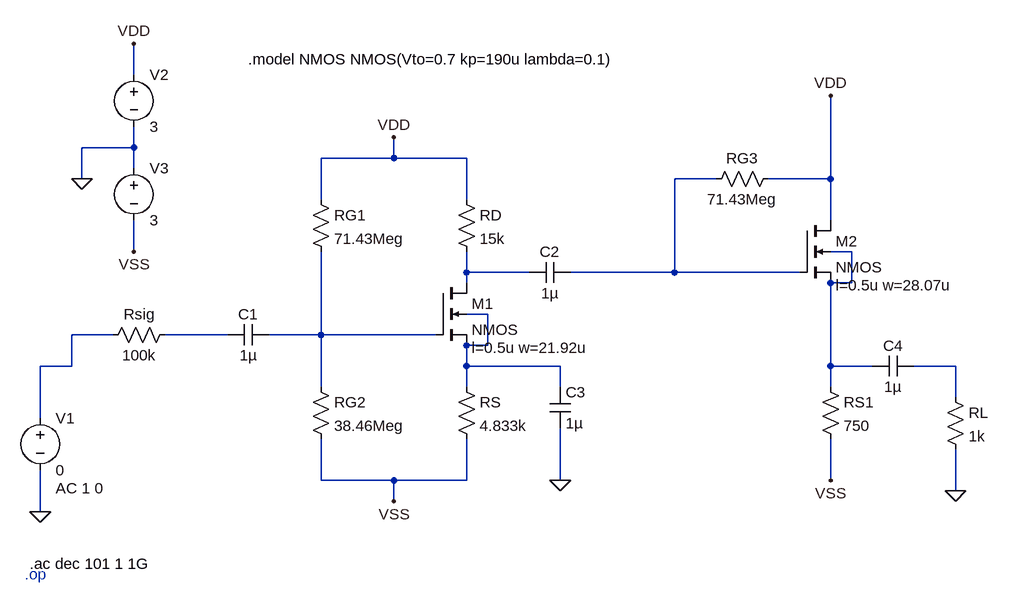
[diagram p0: schematic DiscreteAmplifier.asc]
DiscreteAmplifier.asc, the LTspice schematic file:
Version 4
SHEET 1 1156 680
WIRE -224 -144 -224 -192
WIRE -224 -32 -224 -64
WIRE -224 -32 -304 -32
WIRE 176 -16 176 -48
WIRE 176 -16 64 -16
WIRE 288 -16 176 -16
WIRE -224 0 -224 -32
WIRE -304 16 -304 -32
WIRE 672 16 608 16
WIRE 848 16 848 -112
WIRE 848 16 752 16
WIRE 64 48 64 -16
WIRE 288 48 288 -16
WIRE 848 80 848 16
WIRE -224 128 -224 80
WIRE 880 128 848 128
WIRE 288 160 288 128
WIRE 384 160 288 160
WIRE 608 160 608 16
WIRE 608 160 448 160
WIRE 800 160 608 160
WIRE 288 176 288 160
WIRE 880 176 880 128
WIRE 880 176 848 176
WIRE 320 224 288 224
WIRE -256 256 -320 256
WIRE -80 256 -176 256
WIRE 64 256 64 128
WIRE 64 256 -16 256
WIRE 240 256 64 256
WIRE 320 272 320 224
WIRE 320 272 288 272
WIRE -320 304 -320 256
WIRE -320 304 -368 304
WIRE 288 304 288 272
WIRE 432 304 288 304
WIRE 848 304 848 176
WIRE 912 304 848 304
WIRE 1040 304 976 304
WIRE 64 336 64 256
WIRE 288 336 288 304
WIRE 432 336 432 304
WIRE 848 336 848 304
WIRE 1040 352 1040 304
WIRE -368 384 -368 304
WIRE 64 480 64 416
WIRE 176 480 64 480
WIRE 288 480 288 416
WIRE 288 480 176 480
WIRE 432 480 432 400
WIRE 848 480 848 416
WIRE 1040 496 1040 432
WIRE 176 512 176 480
WIRE -368 528 -368 464
FLAG -368 528 0
FLAG 432 480 0
FLAG -304 16 0
FLAG -224 -192 VDD
FLAG 176 -48 VDD
FLAG -224 128 VSS
FLAG 176 512 VSS
FLAG 848 -112 VDD
FLAG 848 480 VSS
FLAG 1040 496 0
SYMBOL res 48 32 R0
SYMATTR InstName RG1
SYMATTR Value 71.43Meg
SYMBOL res 272 32 R0
SYMATTR InstName RD
SYMATTR Value 15k
SYMBOL nmos4 240 176 R0
WINDOW 123 56 100 Left 2
SYMATTR Value2 l=0.5u w=21.92u
SYMATTR InstName M1
SYMBOL res 272 320 R0
SYMATTR InstName RS
SYMATTR Value 4.833k
SYMBOL res 48 320 R0
SYMATTR InstName RG2
SYMATTR Value 38.46Meg
SYMBOL res -160 240 R90
WINDOW 0 0 56 VBottom 2
WINDOW 3 32 56 VTop 2
SYMATTR InstName Rsig
SYMATTR Value 100k
SYMBOL cap -80 272 R270
WINDOW 0 32 32 VTop 2
WINDOW 3 0 32 VBottom 2
SYMATTR InstName C1
SYMATTR Value 1µ
SYMBOL cap 384 176 R270
WINDOW 0 32 32 VTop 2
WINDOW 3 0 32 VBottom 2
SYMATTR InstName C2
SYMATTR Value 1µ
SYMBOL cap 416 336 R0
SYMATTR InstName C3
SYMATTR Value 1µ
SYMBOL voltage -368 368 R0
WINDOW 123 24 124 Left 2
WINDOW 39 0 0 Left 0
SYMATTR Value2 AC 1 0
SYMATTR InstName V1
SYMATTR Value 0
SYMBOL voltage -224 -160 R0
SYMATTR InstName V2
SYMATTR Value 3
SYMBOL voltage -224 -16 R0
SYMATTR InstName V3
SYMATTR Value 3
SYMBOL res 768 0 R90
WINDOW 0 0 56 VBottom 2
WINDOW 3 32 56 VTop 2
SYMATTR InstName RG3
SYMATTR Value 71.43Meg
SYMBOL nmos4 800 80 R0
WINDOW 123 56 100 Left 2
SYMATTR Value2 l=0.5u w=28.07u
SYMATTR InstName M2
SYMBOL res 832 320 R0
SYMATTR InstName RS1
SYMATTR Value 750
SYMBOL cap 976 288 R90
WINDOW 0 0 32 VBottom 2
WINDOW 3 32 32 VTop 2
SYMATTR InstName C4
SYMATTR Value 1µ
SYMBOL res 1024 336 R0
SYMATTR InstName RL
SYMATTR Value 1k
TEXT -48 -168 Left 2 !.model NMOS NMOS(Vto=0.7 kp=190u lambda=0.1)
TEXT -384 608 Left 2 !.ac dec 101 1 1G
TEXT -392 624 Left 2 ;.op

The netlist it stands for:
* DiscreteAmplifier.asc
RG1 VDD N007 71.43Meg
RD VDD N003 15k
M1 N003 N007 N004 N004 NMOS l=0.5u w=21.92u
RS N004 VSS 4.833k
RG2 N007 VSS 38.46Meg
Rsig N006 N005 100k
C1 N006 N007 1µ
C2 N003 N001 1µ
C3 N004 0 1µ
V1 N005 0 0 AC 1 0
V2 VDD 0 3
V3 0 VSS 3
RG3 VDD N001 71.43Meg
M2 VDD N001 N002 N002 NMOS l=0.5u w=28.07u
RS1 N002 VSS 750
C4 N008 N002 1µ
RL N008 0 1k
.model NMOS NMOS
.model PMOS PMOS
.lib standard.mos
.model NMOS NMOS(Vto=0.7 kp=190u lambda=0.1)
.ac dec 101 1 1G
* .op
.backanno
.end